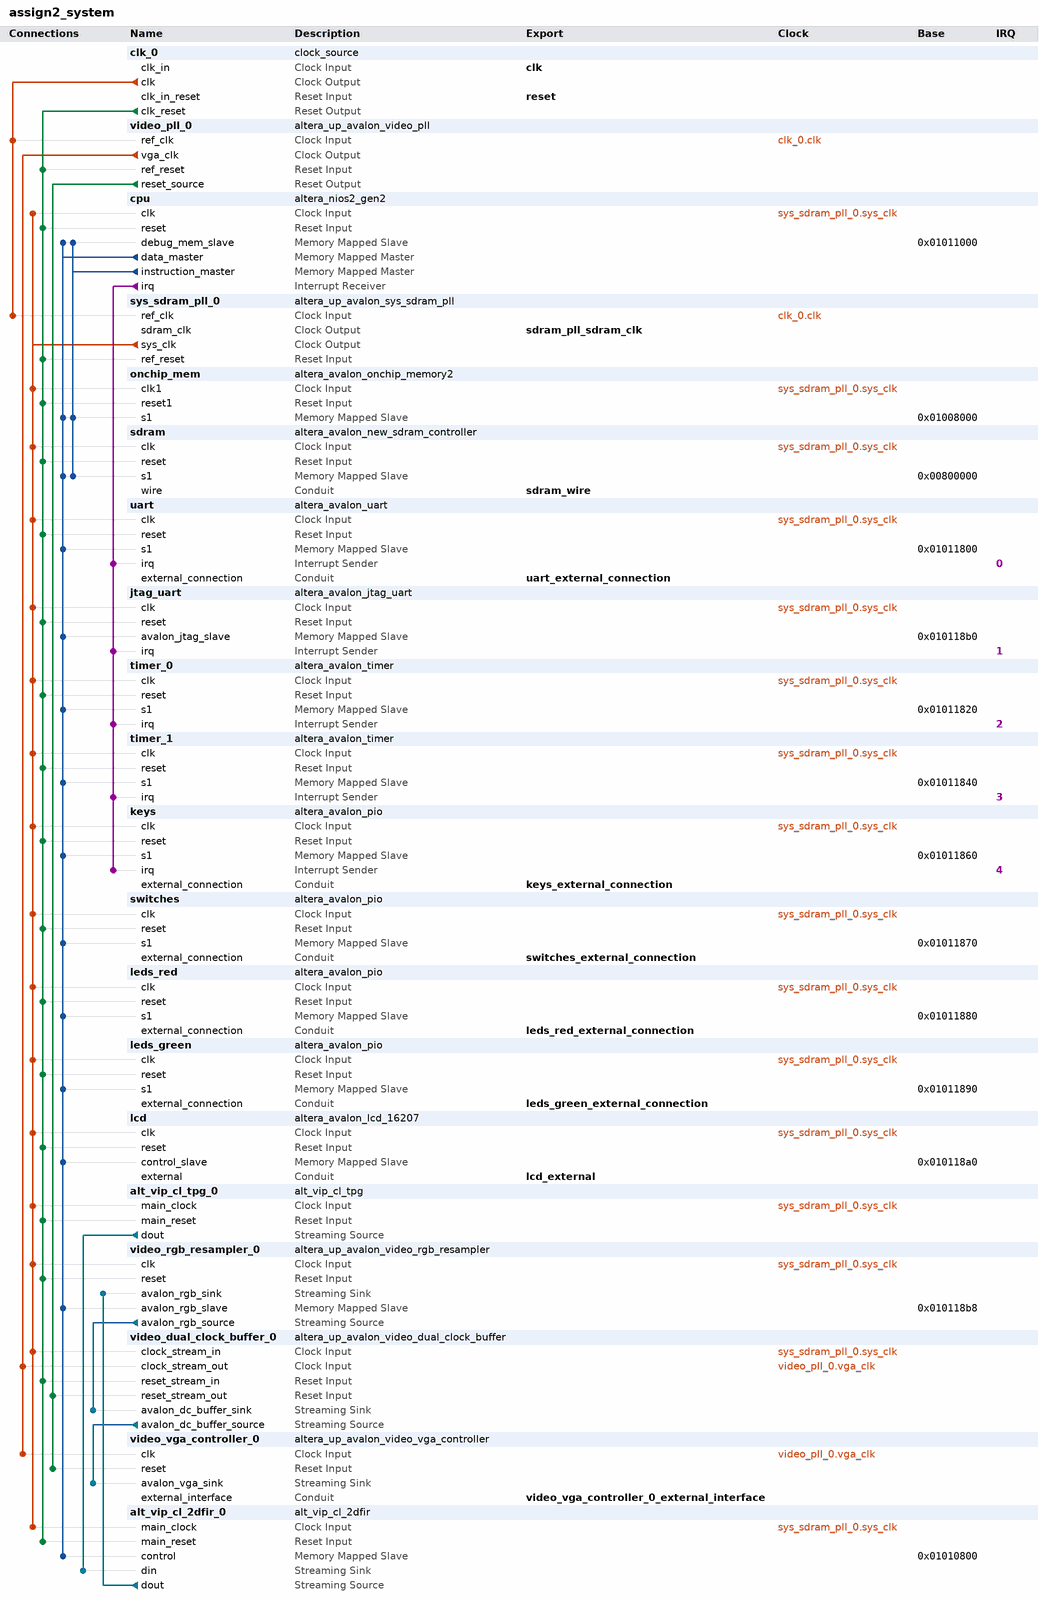
[diagram p0: system contents]
# Platform Designer (Qsys) system assign2_system, Cyclone IV E EP4CE115F29C7
# Parameters at their usual value, and those the tool derives, are not listed.
package require -exact qsys 18.1
create_system assign2_system
set_project_property DEVICE_FAMILY {Cyclone IV E}
set_project_property DEVICE EP4CE115F29C7

add_instance clk_0 clock_source 18.1
set_instance_parameter_value clk_0 clockFrequency 50000000

add_instance video_pll_0 altera_up_avalon_video_pll 18.0
set_instance_parameter_value video_pll_0 camera {5MP Digital Camera (THDB_D5M)}
set_instance_parameter_value video_pll_0 gui_refclk 50.0
set_instance_parameter_value video_pll_0 lcd {7" LCD on VEEK-MT and MTL/MTL2 Modules}

add_instance cpu altera_nios2_gen2 18.1
set_instance_parameter_value cpu dcache_size 2048
set_instance_parameter_value cpu exceptionSlave sdram.s1
set_instance_parameter_value cpu icache_size 4096
set_instance_parameter_value cpu impl Fast
set_instance_parameter_value cpu resetSlave sdram.s1

add_instance sys_sdram_pll_0 altera_up_avalon_sys_sdram_pll 18.0
set_instance_parameter_value sys_sdram_pll_0 CV_boards DE10-Standard
set_instance_parameter_value sys_sdram_pll_0 gui_outclk 50.0
set_instance_parameter_value sys_sdram_pll_0 gui_refclk 50.0

add_instance onchip_mem altera_avalon_onchip_memory2 18.1
set_instance_parameter_value onchip_mem dataWidth 16
set_instance_parameter_value onchip_mem dualPort false
set_instance_parameter_value onchip_mem initMemContent true
set_instance_parameter_value onchip_mem initializationFileName onchip_mem.hex
set_instance_parameter_value onchip_mem memorySize 30720

add_instance sdram altera_avalon_new_sdram_controller 18.1
set_instance_parameter_value sdram TAC 5.5
set_instance_parameter_value sdram TRCD 20.0
set_instance_parameter_value sdram TRP 20.0
set_instance_parameter_value sdram casLatency 3
set_instance_parameter_value sdram columnWidth 8
set_instance_parameter_value sdram dataWidth 16
set_instance_parameter_value sdram generateSimulationModel false
set_instance_parameter_value sdram model single_Micron_MT48LC4M32B2_7_chip
set_instance_parameter_value sdram numberOfBanks 4
set_instance_parameter_value sdram numberOfChipSelects 1
set_instance_parameter_value sdram powerUpDelay 100.0
set_instance_parameter_value sdram refreshPeriod 15.625
set_instance_parameter_value sdram rowWidth 12

add_instance uart altera_avalon_uart 18.1
set_instance_parameter_value uart baud 115200
set_instance_parameter_value uart dataBits 8
set_instance_parameter_value uart fixedBaud true
set_instance_parameter_value uart parity NONE
set_instance_parameter_value uart stopBits 1

add_instance jtag_uart altera_avalon_jtag_uart 18.1
set_instance_parameter_value jtag_uart simInteractiveOptions NO_INTERACTIVE_WINDOWS

add_instance timer_0 altera_avalon_timer 18.1
set_instance_parameter_value timer_0 period 1
set_instance_parameter_value timer_0 periodUnits MSEC

add_instance timer_1 altera_avalon_timer 18.1
set_instance_parameter_value timer_1 period 1
set_instance_parameter_value timer_1 periodUnits MSEC

add_instance keys altera_avalon_pio 18.1
set_instance_parameter_value keys captureEdge true
set_instance_parameter_value keys direction Input
set_instance_parameter_value keys edgeType FALLING
set_instance_parameter_value keys generateIRQ true
set_instance_parameter_value keys irqType EDGE
set_instance_parameter_value keys width 3

add_instance switches altera_avalon_pio 18.1
set_instance_parameter_value switches direction Input
set_instance_parameter_value switches width 18

add_instance leds_red altera_avalon_pio 18.1
set_instance_parameter_value leds_red direction Output
set_instance_parameter_value leds_red width 18

add_instance leds_green altera_avalon_pio 18.1
set_instance_parameter_value leds_green direction Output
set_instance_parameter_value leds_green width 9

add_instance lcd altera_avalon_lcd_16207 18.1

add_instance alt_vip_cl_tpg_0 alt_vip_cl_tpg 18.1
set_instance_parameter_value alt_vip_cl_tpg_0 BITS_PER_SYMBOL 8
set_instance_parameter_value alt_vip_cl_tpg_0 COLOR_PLANES_ARE_IN_PARALLEL 1
set_instance_parameter_value alt_vip_cl_tpg_0 COLOR_SPACE_0 RGB_444
set_instance_parameter_value alt_vip_cl_tpg_0 COLOR_SPACE_1 RGB_444
set_instance_parameter_value alt_vip_cl_tpg_0 COLOR_SPACE_2 RGB_444
set_instance_parameter_value alt_vip_cl_tpg_0 COLOR_SPACE_3 RGB_444
set_instance_parameter_value alt_vip_cl_tpg_0 COLOR_SPACE_4 RGB_444
set_instance_parameter_value alt_vip_cl_tpg_0 COLOR_SPACE_5 RGB_444
set_instance_parameter_value alt_vip_cl_tpg_0 COLOR_SPACE_6 RGB_444
set_instance_parameter_value alt_vip_cl_tpg_0 COLOR_SPACE_7 RGB_444
set_instance_parameter_value alt_vip_cl_tpg_0 DEFAULT_BOARDER 1
set_instance_parameter_value alt_vip_cl_tpg_0 FAMILY {Cyclone IV E}
set_instance_parameter_value alt_vip_cl_tpg_0 INTERLACING PROGRESSIVE
set_instance_parameter_value alt_vip_cl_tpg_0 LIMITED_READBACK 0
set_instance_parameter_value alt_vip_cl_tpg_0 MAX_HEIGHT 480
set_instance_parameter_value alt_vip_cl_tpg_0 MAX_WIDTH 640
set_instance_parameter_value alt_vip_cl_tpg_0 NUMBER_OF_COLOR_PLANES 2
set_instance_parameter_value alt_vip_cl_tpg_0 NUM_CORES 1
set_instance_parameter_value alt_vip_cl_tpg_0 OUTPUT_FORMAT 4.4.4
set_instance_parameter_value alt_vip_cl_tpg_0 PATTERN_0 colorbars
set_instance_parameter_value alt_vip_cl_tpg_0 PATTERN_1 colorbars
set_instance_parameter_value alt_vip_cl_tpg_0 PATTERN_2 colorbars
set_instance_parameter_value alt_vip_cl_tpg_0 PATTERN_3 colorbars
set_instance_parameter_value alt_vip_cl_tpg_0 PATTERN_4 colorbars
set_instance_parameter_value alt_vip_cl_tpg_0 PATTERN_5 colorbars
set_instance_parameter_value alt_vip_cl_tpg_0 PATTERN_6 colorbars
set_instance_parameter_value alt_vip_cl_tpg_0 PATTERN_7 colorbars
set_instance_parameter_value alt_vip_cl_tpg_0 PIPELINE_READY 0
set_instance_parameter_value alt_vip_cl_tpg_0 PIXELS_IN_PARALLEL 1
set_instance_parameter_value alt_vip_cl_tpg_0 RUNTIME_CONTROL 0
set_instance_parameter_value alt_vip_cl_tpg_0 UNIFORM_VALUE_BCR 16
set_instance_parameter_value alt_vip_cl_tpg_0 UNIFORM_VALUE_GCB 16
set_instance_parameter_value alt_vip_cl_tpg_0 UNIFORM_VALUE_RY 16

add_instance video_rgb_resampler_0 altera_up_avalon_video_rgb_resampler 18.0
set_instance_parameter_value video_rgb_resampler_0 alpha 1023
set_instance_parameter_value video_rgb_resampler_0 input_type {24-bit RGB}
set_instance_parameter_value video_rgb_resampler_0 output_type {30-bit RGB}

add_instance video_dual_clock_buffer_0 altera_up_avalon_video_dual_clock_buffer 18.0
set_instance_parameter_value video_dual_clock_buffer_0 color_bits 10

add_instance video_vga_controller_0 altera_up_avalon_video_vga_controller 18.0
set_instance_parameter_value video_vga_controller_0 board DE2-115
set_instance_parameter_value video_vga_controller_0 resolution {VGA 640x480}

add_instance alt_vip_cl_2dfir_0 alt_vip_cl_2dfir 18.1
set_instance_parameter_value alt_vip_cl_2dfir_0 ALGORITHM_NAME STANDARD_FIR
set_instance_parameter_value alt_vip_cl_2dfir_0 BITS_PER_SYMBOL_IN 8
set_instance_parameter_value alt_vip_cl_2dfir_0 BITS_PER_SYMBOL_OUT 8
set_instance_parameter_value alt_vip_cl_2dfir_0 COEFF_FRACTION_BITS 0
set_instance_parameter_value alt_vip_cl_2dfir_0 COEFF_INTEGER_BITS 3
set_instance_parameter_value alt_vip_cl_2dfir_0 COEFF_SIGNED 1
set_instance_parameter_value alt_vip_cl_2dfir_0 COLOR_PLANES_ARE_IN_PARALLEL 1
set_instance_parameter_value alt_vip_cl_2dfir_0 DEFAULT_LOWER_BLUR 0
set_instance_parameter_value alt_vip_cl_2dfir_0 DEFAULT_UPPER_BLUR 15
set_instance_parameter_value alt_vip_cl_2dfir_0 DIAG_SYMMETRIC 0
set_instance_parameter_value alt_vip_cl_2dfir_0 DO_MIRRORING 1
set_instance_parameter_value alt_vip_cl_2dfir_0 ENABLE_WIDE_BLUR_SHARPEN 1
set_instance_parameter_value alt_vip_cl_2dfir_0 EXTRA_PIPELINING 0
set_instance_parameter_value alt_vip_cl_2dfir_0 FAMILY {Cyclone IV E}
set_instance_parameter_value alt_vip_cl_2dfir_0 FIXED_COEFF_FILE "\\\\files.auckland.ac.nz\\myhome\\Documents\\GitHub\\video-processing-group-10\\Quartus\\pokeY.txt"
set_instance_parameter_value alt_vip_cl_2dfir_0 H_SYMMETRIC 0
set_instance_parameter_value alt_vip_cl_2dfir_0 H_TAPS 3
set_instance_parameter_value alt_vip_cl_2dfir_0 INPUT_GUARD_BANDS_ENABLE 0
set_instance_parameter_value alt_vip_cl_2dfir_0 INPUT_GUARD_BAND_LOWER 0
set_instance_parameter_value alt_vip_cl_2dfir_0 INPUT_GUARD_BAND_UPPER 255
set_instance_parameter_value alt_vip_cl_2dfir_0 IS_422 0
set_instance_parameter_value alt_vip_cl_2dfir_0 LIMITED_READBACK 0
set_instance_parameter_value alt_vip_cl_2dfir_0 MAX_HEIGHT 480
set_instance_parameter_value alt_vip_cl_2dfir_0 MAX_WIDTH 640
set_instance_parameter_value alt_vip_cl_2dfir_0 MOVE_BINARY_POINT_RIGHT 0
set_instance_parameter_value alt_vip_cl_2dfir_0 NO_BLANKING 0
set_instance_parameter_value alt_vip_cl_2dfir_0 NUMBER_OF_COLOR_PLANES 3
set_instance_parameter_value alt_vip_cl_2dfir_0 OUTPUT_GUARD_BANDS_ENABLE 1
set_instance_parameter_value alt_vip_cl_2dfir_0 OUTPUT_GUARD_BAND_LOWER 0
set_instance_parameter_value alt_vip_cl_2dfir_0 OUTPUT_GUARD_BAND_UPPER 255
set_instance_parameter_value alt_vip_cl_2dfir_0 PIXELS_IN_PARALLEL 1
set_instance_parameter_value alt_vip_cl_2dfir_0 ROUNDING_METHOD ROUND_HALF_UP
set_instance_parameter_value alt_vip_cl_2dfir_0 RUNTIME_CONTROL 1
set_instance_parameter_value alt_vip_cl_2dfir_0 USER_PACKET_SUPPORT PASSTHROUGH
set_instance_parameter_value alt_vip_cl_2dfir_0 V_SYMMETRIC 0
set_instance_parameter_value alt_vip_cl_2dfir_0 V_TAPS 3

# connections
add_connection clk_0.clk sys_sdram_pll_0.ref_clk clock
add_connection clk_0.clk video_pll_0.ref_clk clock
add_connection sys_sdram_pll_0.sys_clk alt_vip_cl_2dfir_0.main_clock clock
add_connection sys_sdram_pll_0.sys_clk alt_vip_cl_tpg_0.main_clock clock
add_connection sys_sdram_pll_0.sys_clk cpu.clk clock
add_connection sys_sdram_pll_0.sys_clk jtag_uart.clk clock
add_connection sys_sdram_pll_0.sys_clk keys.clk clock
add_connection sys_sdram_pll_0.sys_clk lcd.clk clock
add_connection sys_sdram_pll_0.sys_clk leds_green.clk clock
add_connection sys_sdram_pll_0.sys_clk leds_red.clk clock
add_connection sys_sdram_pll_0.sys_clk onchip_mem.clk1 clock
add_connection sys_sdram_pll_0.sys_clk sdram.clk clock
add_connection sys_sdram_pll_0.sys_clk switches.clk clock
add_connection sys_sdram_pll_0.sys_clk timer_0.clk clock
add_connection sys_sdram_pll_0.sys_clk timer_1.clk clock
add_connection sys_sdram_pll_0.sys_clk uart.clk clock
add_connection sys_sdram_pll_0.sys_clk video_dual_clock_buffer_0.clock_stream_in clock
add_connection sys_sdram_pll_0.sys_clk video_rgb_resampler_0.clk clock
add_connection video_pll_0.vga_clk video_dual_clock_buffer_0.clock_stream_out clock
add_connection video_pll_0.vga_clk video_vga_controller_0.clk clock
add_connection clk_0.clk_reset alt_vip_cl_2dfir_0.main_reset reset
add_connection clk_0.clk_reset alt_vip_cl_tpg_0.main_reset reset
add_connection clk_0.clk_reset cpu.reset reset
add_connection clk_0.clk_reset jtag_uart.reset reset
add_connection clk_0.clk_reset keys.reset reset
add_connection clk_0.clk_reset lcd.reset reset
add_connection clk_0.clk_reset leds_green.reset reset
add_connection clk_0.clk_reset leds_red.reset reset
add_connection clk_0.clk_reset onchip_mem.reset1 reset
add_connection clk_0.clk_reset sdram.reset reset
add_connection clk_0.clk_reset switches.reset reset
add_connection clk_0.clk_reset sys_sdram_pll_0.ref_reset reset
add_connection clk_0.clk_reset timer_0.reset reset
add_connection clk_0.clk_reset timer_1.reset reset
add_connection clk_0.clk_reset uart.reset reset
add_connection clk_0.clk_reset video_dual_clock_buffer_0.reset_stream_in reset
add_connection clk_0.clk_reset video_pll_0.ref_reset reset
add_connection clk_0.clk_reset video_rgb_resampler_0.reset reset
add_connection video_pll_0.reset_source video_dual_clock_buffer_0.reset_stream_out reset
add_connection video_pll_0.reset_source video_vga_controller_0.reset reset
add_connection cpu.data_master alt_vip_cl_2dfir_0.control avalon
set_connection_parameter_value cpu.data_master/alt_vip_cl_2dfir_0.control baseAddress 0x01010800
add_connection cpu.data_master cpu.debug_mem_slave avalon
set_connection_parameter_value cpu.data_master/cpu.debug_mem_slave baseAddress 0x01011000
add_connection cpu.data_master jtag_uart.avalon_jtag_slave avalon
set_connection_parameter_value cpu.data_master/jtag_uart.avalon_jtag_slave baseAddress 0x010118b0
add_connection cpu.data_master keys.s1 avalon
set_connection_parameter_value cpu.data_master/keys.s1 baseAddress 0x01011860
add_connection cpu.data_master lcd.control_slave avalon
set_connection_parameter_value cpu.data_master/lcd.control_slave baseAddress 0x010118a0
add_connection cpu.data_master leds_green.s1 avalon
set_connection_parameter_value cpu.data_master/leds_green.s1 baseAddress 0x01011890
add_connection cpu.data_master leds_red.s1 avalon
set_connection_parameter_value cpu.data_master/leds_red.s1 baseAddress 0x01011880
add_connection cpu.data_master onchip_mem.s1 avalon
set_connection_parameter_value cpu.data_master/onchip_mem.s1 baseAddress 0x01008000
add_connection cpu.data_master sdram.s1 avalon
set_connection_parameter_value cpu.data_master/sdram.s1 baseAddress 0x00800000
add_connection cpu.data_master switches.s1 avalon
set_connection_parameter_value cpu.data_master/switches.s1 baseAddress 0x01011870
add_connection cpu.data_master timer_0.s1 avalon
set_connection_parameter_value cpu.data_master/timer_0.s1 baseAddress 0x01011820
add_connection cpu.data_master timer_1.s1 avalon
set_connection_parameter_value cpu.data_master/timer_1.s1 baseAddress 0x01011840
add_connection cpu.data_master uart.s1 avalon
set_connection_parameter_value cpu.data_master/uart.s1 baseAddress 0x01011800
add_connection cpu.data_master video_rgb_resampler_0.avalon_rgb_slave avalon
set_connection_parameter_value cpu.data_master/video_rgb_resampler_0.avalon_rgb_slave baseAddress 0x010118b8
add_connection cpu.instruction_master cpu.debug_mem_slave avalon
set_connection_parameter_value cpu.instruction_master/cpu.debug_mem_slave baseAddress 0x01011000
add_connection cpu.instruction_master onchip_mem.s1 avalon
set_connection_parameter_value cpu.instruction_master/onchip_mem.s1 baseAddress 0x01008000
add_connection cpu.instruction_master sdram.s1 avalon
set_connection_parameter_value cpu.instruction_master/sdram.s1 baseAddress 0x00800000
add_connection alt_vip_cl_2dfir_0.dout video_rgb_resampler_0.avalon_rgb_sink avalon_streaming
add_connection alt_vip_cl_tpg_0.dout alt_vip_cl_2dfir_0.din avalon_streaming
add_connection video_dual_clock_buffer_0.avalon_dc_buffer_source video_vga_controller_0.avalon_vga_sink avalon_streaming
add_connection video_rgb_resampler_0.avalon_rgb_source video_dual_clock_buffer_0.avalon_dc_buffer_sink avalon_streaming
add_connection cpu.irq jtag_uart.irq interrupt
set_connection_parameter_value cpu.irq/jtag_uart.irq irqNumber 1
add_connection cpu.irq keys.irq interrupt
set_connection_parameter_value cpu.irq/keys.irq irqNumber 4
add_connection cpu.irq timer_0.irq interrupt
set_connection_parameter_value cpu.irq/timer_0.irq irqNumber 2
add_connection cpu.irq timer_1.irq interrupt
set_connection_parameter_value cpu.irq/timer_1.irq irqNumber 3
add_connection cpu.irq uart.irq interrupt
set_connection_parameter_value cpu.irq/uart.irq irqNumber 0

# exported interfaces
add_interface clk clock sink
set_interface_property clk EXPORT_OF clk_0.clk_in
add_interface keys_external_connection conduit end
set_interface_property keys_external_connection EXPORT_OF keys.external_connection
add_interface lcd_external conduit end
set_interface_property lcd_external EXPORT_OF lcd.external
add_interface leds_green_external_connection conduit end
set_interface_property leds_green_external_connection EXPORT_OF leds_green.external_connection
add_interface leds_red_external_connection conduit end
set_interface_property leds_red_external_connection EXPORT_OF leds_red.external_connection
add_interface reset reset sink
set_interface_property reset EXPORT_OF clk_0.clk_in_reset
add_interface sdram_pll_sdram_clk clock source
set_interface_property sdram_pll_sdram_clk EXPORT_OF sys_sdram_pll_0.sdram_clk
add_interface sdram_wire conduit end
set_interface_property sdram_wire EXPORT_OF sdram.wire
add_interface switches_external_connection conduit end
set_interface_property switches_external_connection EXPORT_OF switches.external_connection
add_interface uart_external_connection conduit end
set_interface_property uart_external_connection EXPORT_OF uart.external_connection
add_interface video_vga_controller_0_external_interface conduit end
set_interface_property video_vga_controller_0_external_interface EXPORT_OF video_vga_controller_0.external_interface

set_interconnect_requirement {$system} qsys_mm.clockCrossingAdapter HANDSHAKE
set_interconnect_requirement {$system} qsys_mm.enableEccProtection FALSE
set_interconnect_requirement {$system} qsys_mm.insertDefaultSlave FALSE
set_interconnect_requirement {$system} qsys_mm.maxAdditionalLatency 1

save_system assign2_system.qsys
